# Altium schematic sheet PAGE1 - CONTENTS.SchDoc
size A3; DocumentNumber: 1; SheetNumber: 1; SheetTotal: 4
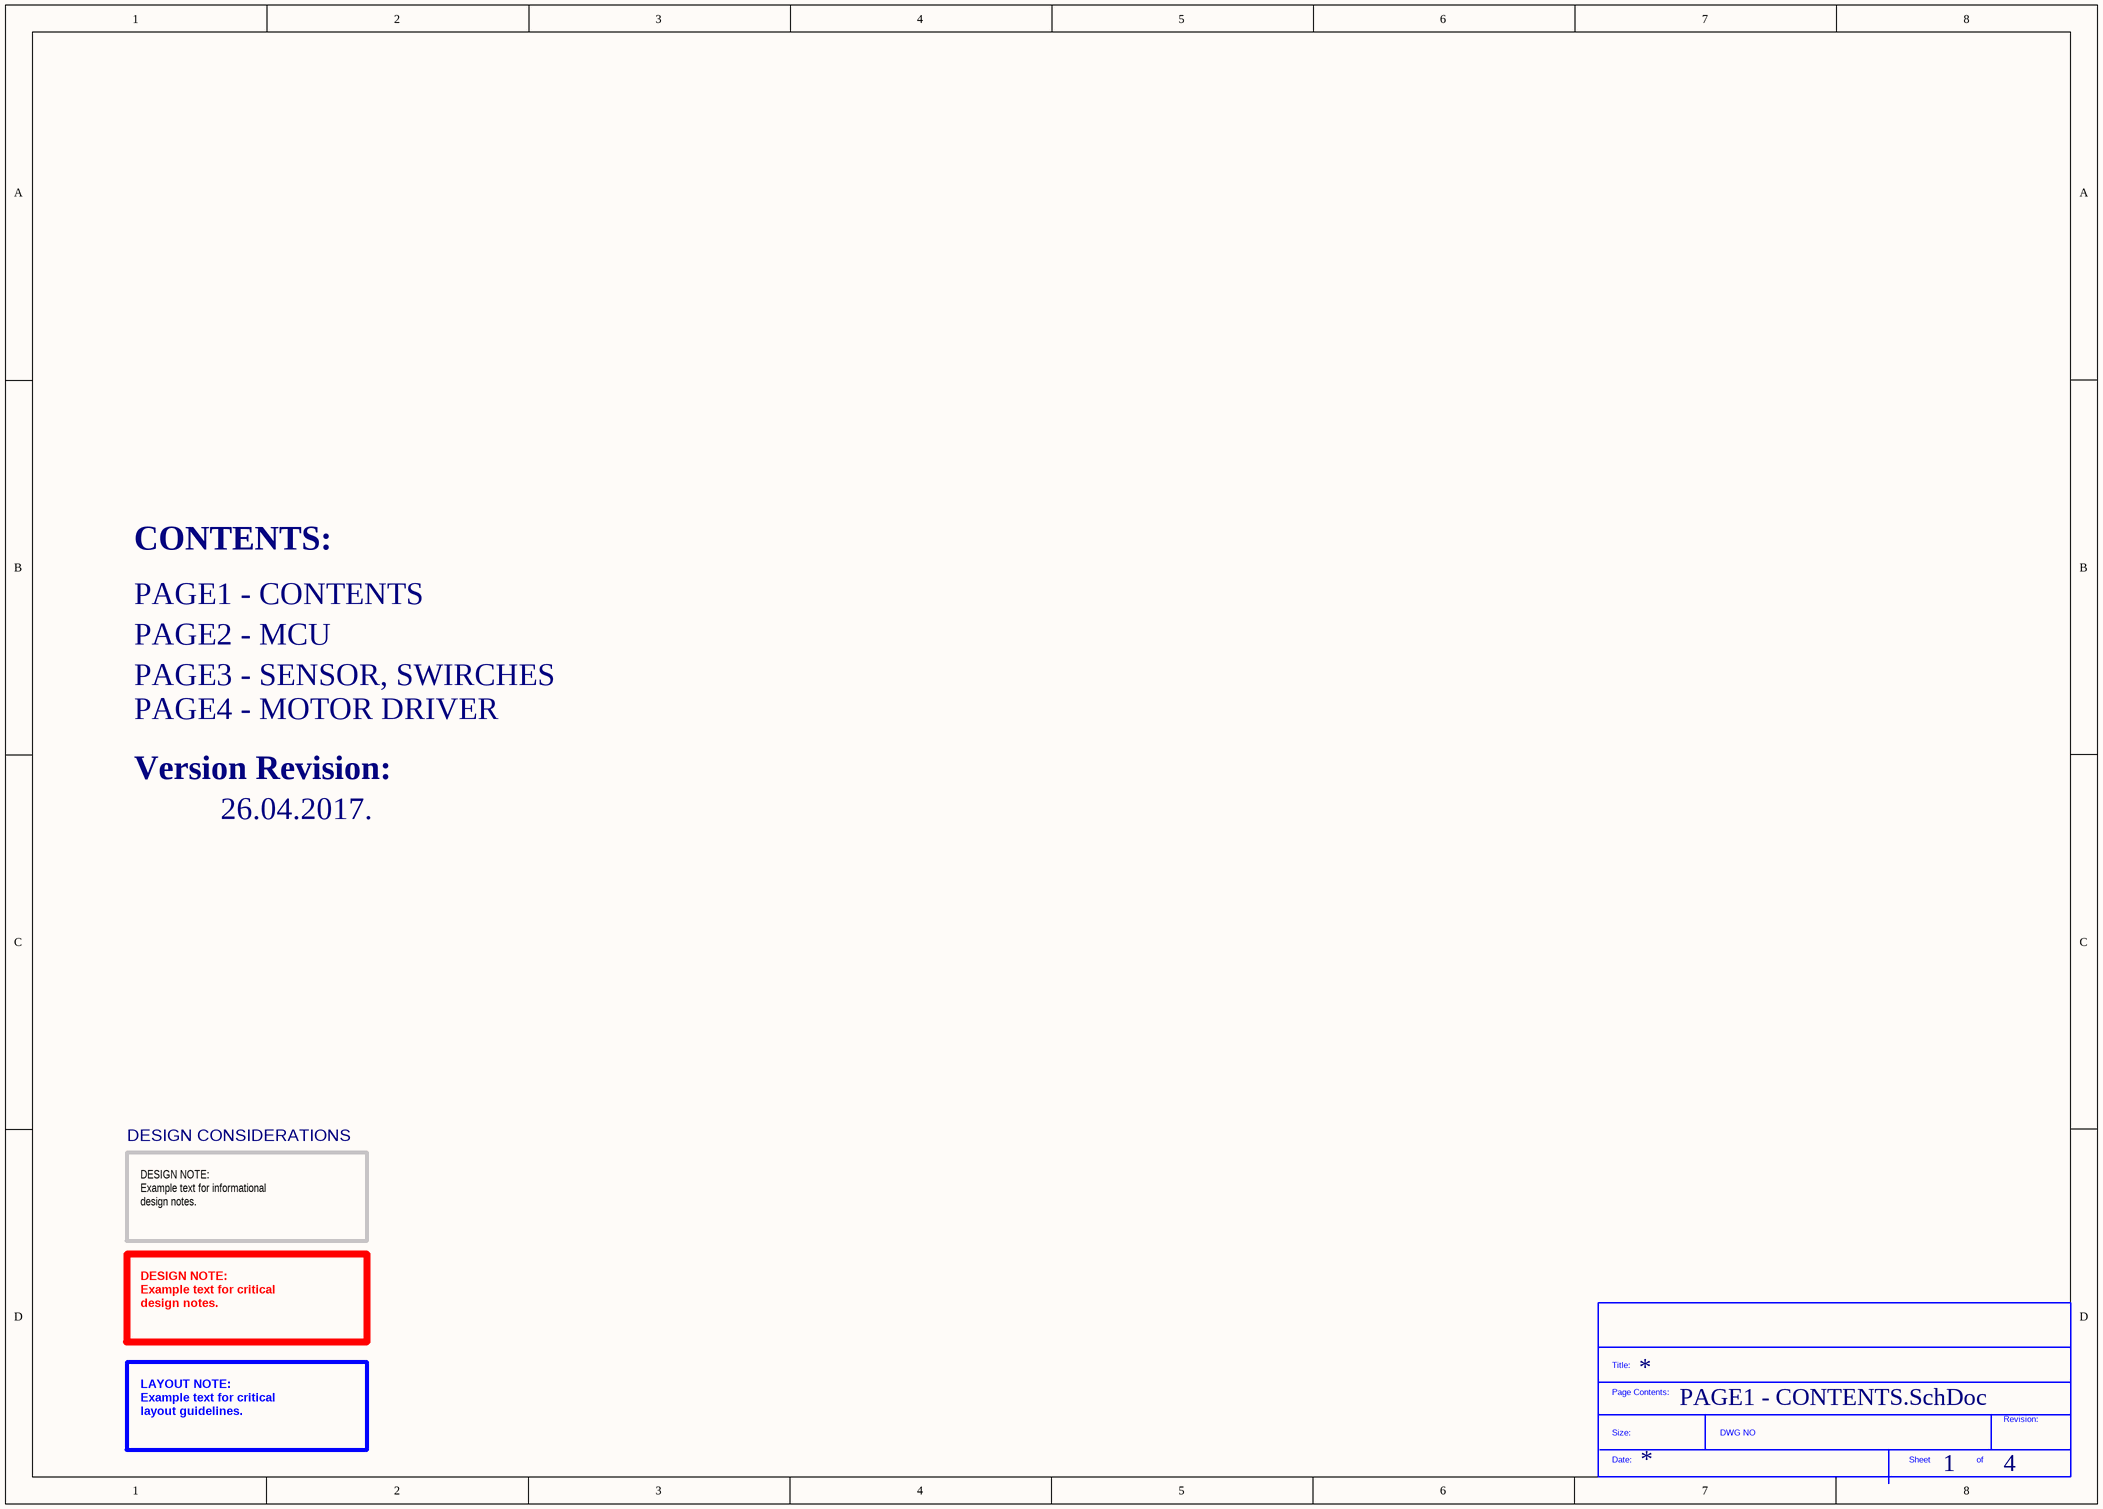
[diagram p0: PAGE1 - CONTENTS.SchDoc]

## Parts
*?  SDTitleBlock  (value not drawn)  (graphical)

## Notes on the sheet
- CONTENTS:
- PAGE1 - CONTENTS
- PAGE2 - MCU
- PAGE3 - SENSOR, SWIRCHES
- PAGE4 - MOTOR DRIVER
- Version Revision:
- 26.04.2017.
- DESIGN CONSIDERATIONS
- DESIGN NOTE:
  Example text for informational
  design notes.
- DESIGN NOTE:
  Example text for critical
  design notes.
- LAYOUT NOTE:
  Example text for critical
  layout guidelines.
- (in symbol SDTitleBlock) Title:; Page Contents:; Revision:; Size:; DWG NO; Date:; Sheet; of